# Altium schematic sheet COM-CDH.SchDoc: CDH Connector
size B; CompanyName: Lockheed Martin; Organization: Colorado Space Grant; DocumentNumber: 4; SheetNumber: 2; SheetTotal: 7; ProjectName: COM_Digital.prjpcb
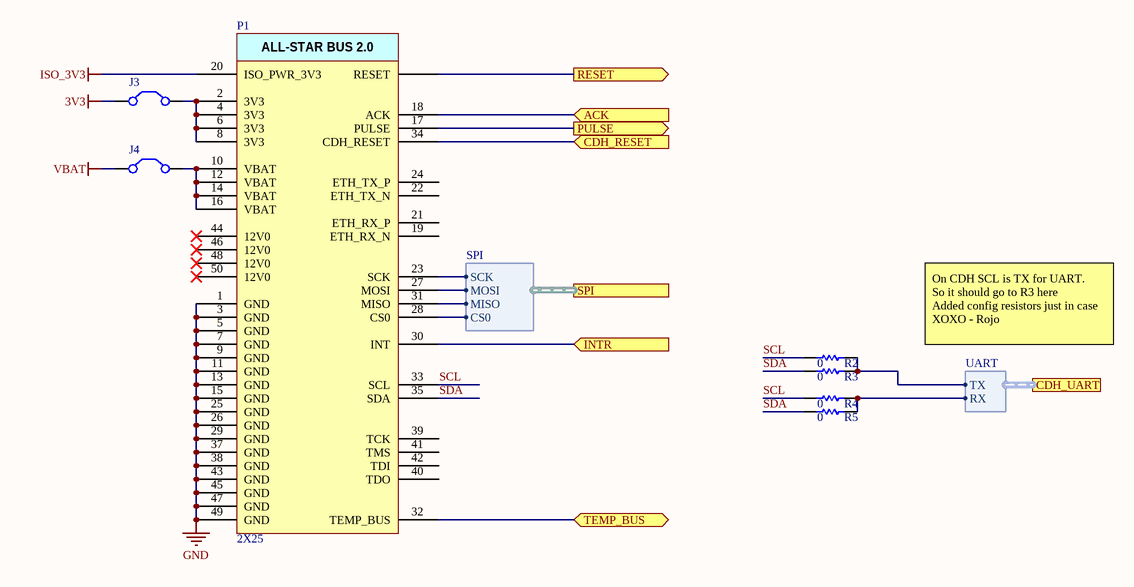
[diagram p0: COM-CDH.SchDoc]

## Parts
J3  Jumper  [C1206]  (value not drawn)
J4  Jumper  [C1206]  (value not drawn)
P1  2X25  [LS2-125-01-X-D-RA1]
R2  Resistance: 0  [1608[0603]]  (hidden comment: CRCW06030000Z0EAC)  (no BOM)
R3  Resistance: 0  [1608[0603]]  (hidden comment: CRCW06030000Z0EAC)
R4  Resistance: 0  [1608[0603]]  (hidden comment: CRCW06030000Z0EAC)
R5  Resistance: 0  [1608[0603]]  (hidden comment: CRCW06030000Z0EAC)  (no BOM)

## Ports
ACK (in), CDH_RESET (in), CDH_UART (harness UART), INTR (in), PULSE (out), RESET (out), SPI (harness SPI), TEMP_BUS (bidir)

## Harnesses
SPI: CS0, MISO, MOSI, SCK
UART: RX, TX

## Nets
3V3: J3.1(C1)
GND: P1.1(GND) P1.3(GND) P1.5(GND) P1.7(GND) P1.9(GND) P1.11(GND) P1.13(GND) P1.15(GND) P1.25(GND) P1.26(GND) P1.29(GND) P1.37(GND) P1.38(GND) P1.43(GND) P1.45(GND) P1.47(GND) P1.49(GND)
ISO_3V3: P1.20(ISO_PWR_3V3)
VBAT: J4.1(C1)
ACK: P1.18(ACK) ; port ACK
CDH_RESET: P1.34(CDH_RESET) ; port CDH_RESET
INTR: P1.30(INT) ; port INTR
PULSE: P1.17(PULSE) ; port PULSE
RESET: P1.36(RESET) ; port RESET
SCL: P1.33(SCL) R2.1 R4.1
SDA: P1.35(SDA) R3.1 R5.1
TEMP_BUS: P1.32(TEMP_BUS) ; port TEMP_BUS
NetJ3_2: J3.2(C2) P1.2(3V3) P1.4(3V3) P1.6(3V3) P1.8(3V3)
NetJ4_2: J4.2(C2) P1.10(VBAT) P1.12(VBAT) P1.14(VBAT) P1.16(VBAT)
NetP1_23: P1.23(SCK) ; port SPI.SCK
NetP1_27: P1.27(MOSI) ; port SPI.MOSI
NetP1_28: P1.28(CS0) ; port SPI.CS0
NetP1_31: P1.31(MISO) ; port SPI.MISO
NetR2_2: R2.2 R3.2 ; port CDH_UART.TX
NetR4_2: R4.2 R5.2 ; port CDH_UART.RX

Not connected (* = marked no-connect by the designer): P1 19(ETH_RX_N) 21(ETH_RX_P) 22(ETH_TX_N) 24(ETH_TX_P) 39(TCK) 40(TDO) 41(TMS) 42(TDI) 44(12V0)* 46(12V0)* 48(12V0)* 50(12V0)*

## Notes on the sheet
- On CDH SCL is TX for UART.
  So it should go to R3 here
  Added config resistors just in case
  XOXO - Rojo
- Title
- Board
- Date
- Engineer
- Filename
- Sheet
- of
- REV
- Polar Cube
- (in symbol 4669) ALL-STAR BUS 2.0

## Library data of the parts
J3 J4 = Jumper: Jumper Wire; Published: 24-Mar-1999; LatestRevisionDate: 17-Jul-2002; LatestRevisionNote: Re-released for DXP Platform.; PackageReference: RAD-0.2; Publisher: Altium Limited; PackageDescription: Radial Cap, Thru-Hole; 2 Leads; 0.2 in Pin Spacing
P1 = 4669: 2.00 mm Locking Hermaphroditic Terminal/Socke; Manufacturer: Samtec; ID: 4669; Pitch: 2.00mm; Pins per Row: 25; Rows: 2; PartNumber: LS2-125-01-X-D-RA1; Category: Through-hole; Status: Unchecked; Type: Terminal/Socket; ComponentLink1Description: Datasheet; ComponentLink1URL: http://www.samtec.com/documents/webfiles/cpdf/LS2-1XX-XX-XX-D-XXX-X-MKT.pdf
R2-R5 = 20995: RES SMD 0 OHM JUMP 1/10W 0603; Manufacturer: Vishay; ID: 20995; Power: 0.1W, 1/10W; Tolerance: Jumper; PartNumber: CRCW06030000Z0EA; Category: General Purpose; Status: Unchecked; Package: 0603 (1608 Metric); ComponentLink1Description: Datasheet; ComponentLink1URL: http://www.vishay.com/doc?20035